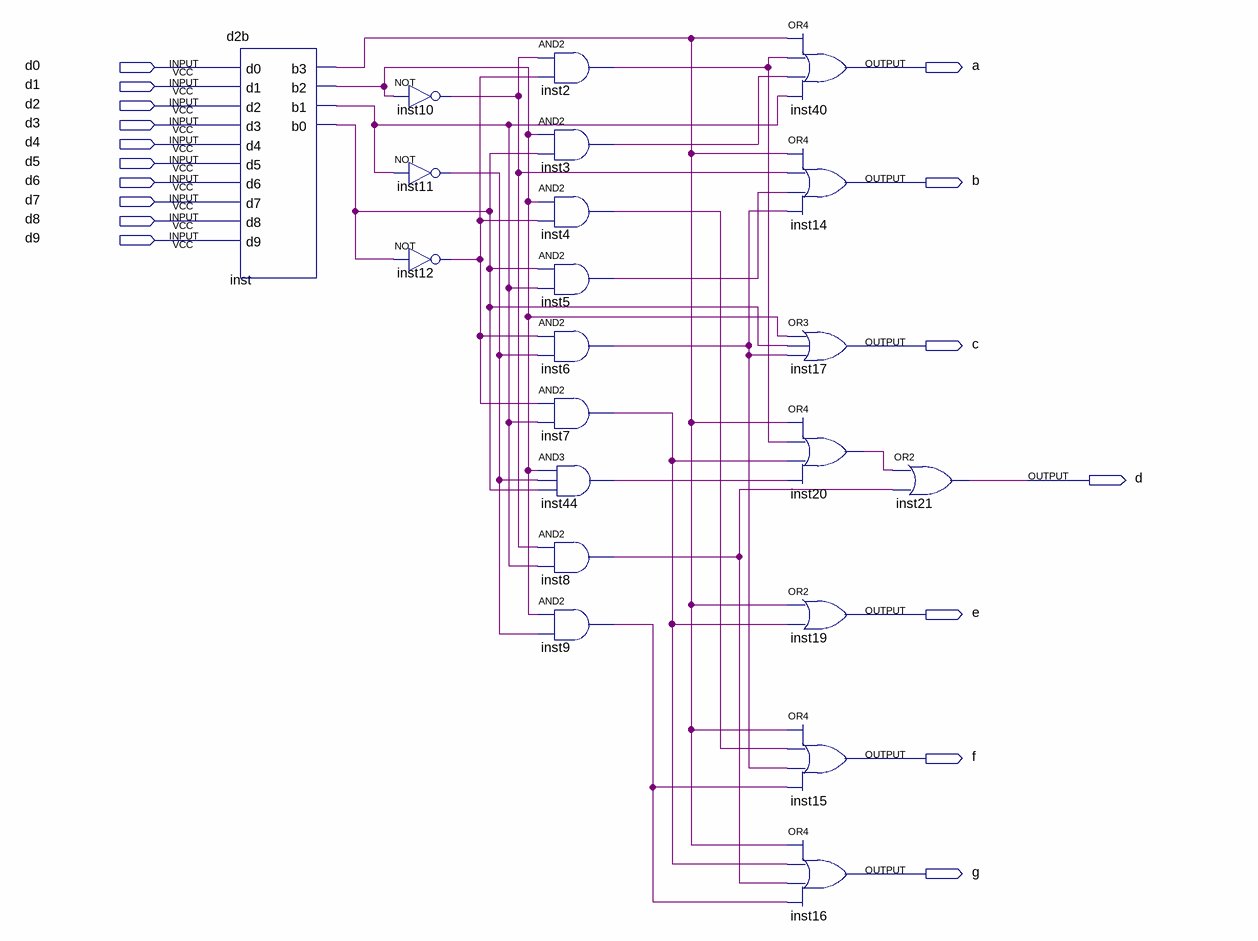
[diagram p0: schematic sheet]
// Quartus schematic bto7.bdf as structural Verilog: 21 symbols, 17 pins
module bto7 (
  input  d0,
  input  d1,
  input  d2,
  input  d3,
  input  d4,
  input  d5,
  input  d6,
  input  d7,
  input  d8,
  input  d9,
  output a,
  output b,
  output c,
  output d,
  output e,
  output f,
  output g
);

  wire inst2_out, inst3_out, inst4_out, inst5_out, inst6_out, inst7_out, inst8_out, inst9_out, inst10_out,
       inst11_out, inst12_out, inst20_out, inst44_out, inst_b0, inst_b1, inst_b2, inst_b3;

  d2b inst (
    .d0(d0), .d1(d1), .d2(d2), .d3(d3), .d4(d4), .d5(d5), .d6(d6), .d7(d7), .d8(d8), .d9(d9), .b3(inst_b3),
    .b2(inst_b2), .b1(inst_b1), .b0(inst_b0));
  not inst10 (inst10_out, inst_b2);
  not inst11 (inst11_out, inst_b1);
  not inst12 (inst12_out, inst_b0);
  and inst2 (inst2_out, inst10_out, inst12_out);
  and inst3 (inst3_out, inst_b2, inst_b0);
  and inst4 (inst4_out, inst_b2, inst12_out);
  and inst5 (inst5_out, inst_b0, inst_b1);
  and inst6 (inst6_out, inst12_out, inst11_out);
  and inst7 (inst7_out, inst12_out, inst_b1);
  and inst44 (inst44_out, inst_b2, inst11_out, inst_b0);
  and inst8 (inst8_out, inst10_out, inst_b1);
  and inst9 (inst9_out, inst_b2, inst11_out);
  or inst40 (a, inst_b3, inst2_out, inst3_out, inst_b1);
  or inst14 (b, inst_b3, inst10_out, inst5_out, inst6_out);
  or inst17 (c, inst_b2, inst_b0, inst6_out);
  or inst20 (inst20_out, inst_b3, inst2_out, inst7_out, inst44_out);
  or inst19 (e, inst_b3, inst7_out);
  or inst15 (f, inst_b3, inst4_out, inst6_out, inst9_out);
  or inst16 (g, inst_b3, inst7_out, inst8_out, inst9_out);
  or inst21 (d, inst20_out, inst8_out);
endmodule
